# EAGLE design 2021_06_29_V7 (EAGLE 9.6.2)
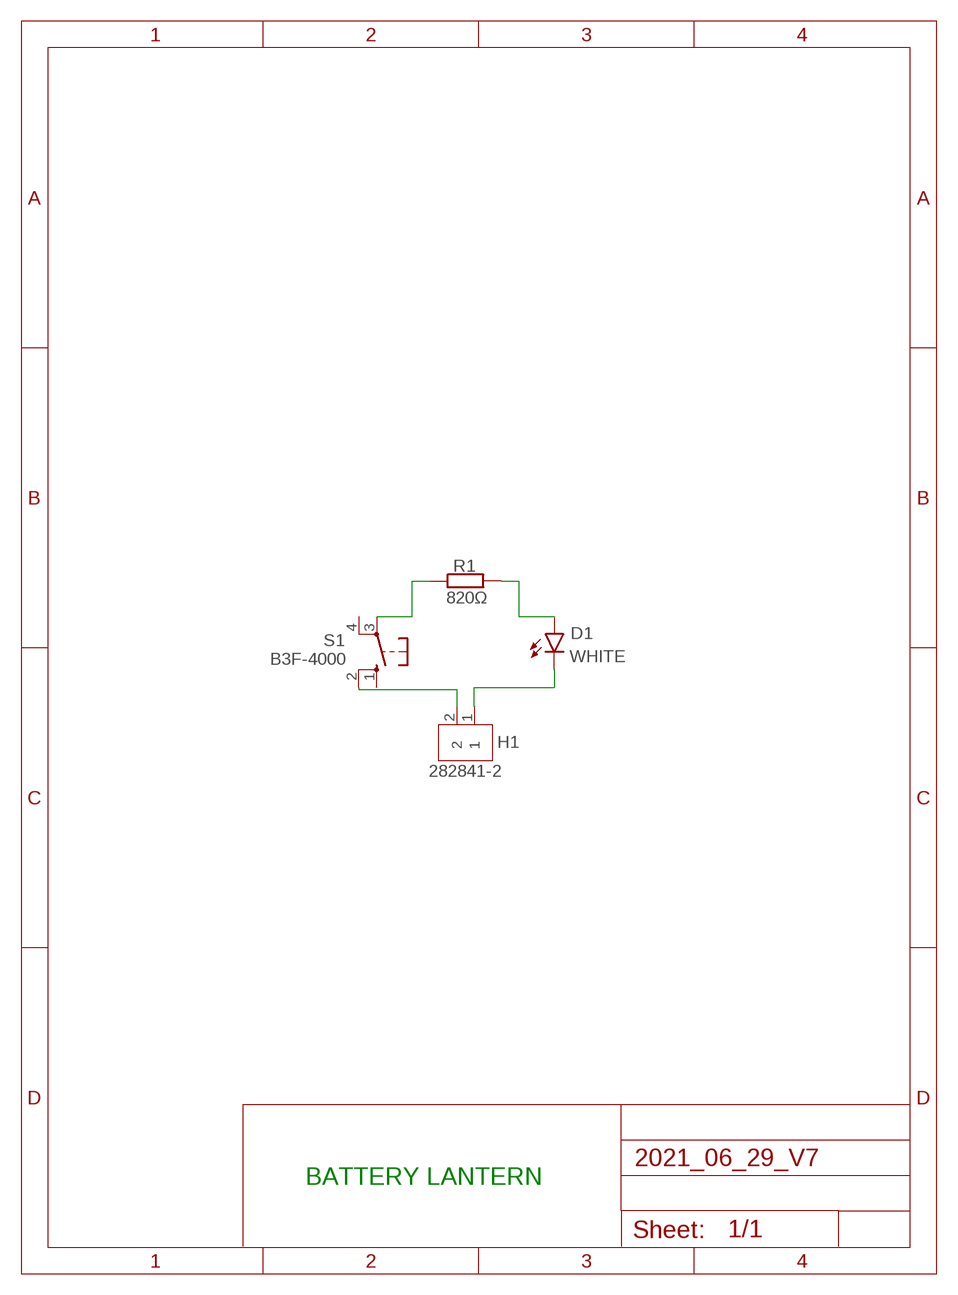
[diagram p0: schematic, sheet 1]

## Parts
D1  WHITE  LED_RADIAL_WHITE  [LEDRD254W60D565H860B_W]
H1  282841-2  2828XX-2282837-2  [TERMBLK_508-2N]
R1  820Ω  R-EU_0207/7  [0207/7]
S1  B3F-4000  40-XX  [B3F-40XX]

## Nets
N$1: H1.2 S1.2(S1)
N$2: R1.1 S1.3(P)
N$3: D1.1(A) R1.2
N$4: D1.2(C) H1.1
Unconnected: S1.1(S) S1.4(P1)

## Notes on the sheet
- BATTERY LANTERN

## Library data of the parts
D1 = Opto-Electronic_1:LED_RADIAL: LED - Generic; CATEGORY: Opto-Electronic; SUB-CATEGORY: LED; VALUE: LED_WHITE
H1 = Connector1:2828XX-2: 2 Position Wire to Board Terminal Block Horizontal with Board Datasheet <https://www.te.com.cn/commerce/DocumentDelivery/DDEController?Action=showdoc&DocId=Catalog+Section%7F1308389_EUROSTYLE_TERMINAL_BLOCKS%7F0607%7Fpdf%7FEnglish%7FENG_CS_1308389_EUROSTYLE_TERMINAL_BLOCKS_0607.pdf%7F2-282837-5>; CATEGORY: Connector; DESCRIPTION: 2 Position Wire to Board Terminal Block Horizontal with Board 5.08 mm Through Hole; MANUFACTURER: TE Connectivity; MPN: 282837-2; OPERATING_TEMPERATURE: -40°C to +105°C; PART_STATUS: ACTIVE; ROHS_COMPLIANCE: RoHS Compliant; SERIES: 282837; SUBCATEGORY: Terminal Block; TYPE: Side Wire Entry
R1 = rclv1:R-EU_: RESISTOR, European symbol; SPICEPREFIX: R
S1 = switch-omron:40-XX: OMRON SWITCH; MF: OMRON COMPONENTS USA; MPN: B3F-4000; OC_FARNELL: 176434; OC_NEWARK: 36K3105

## Board
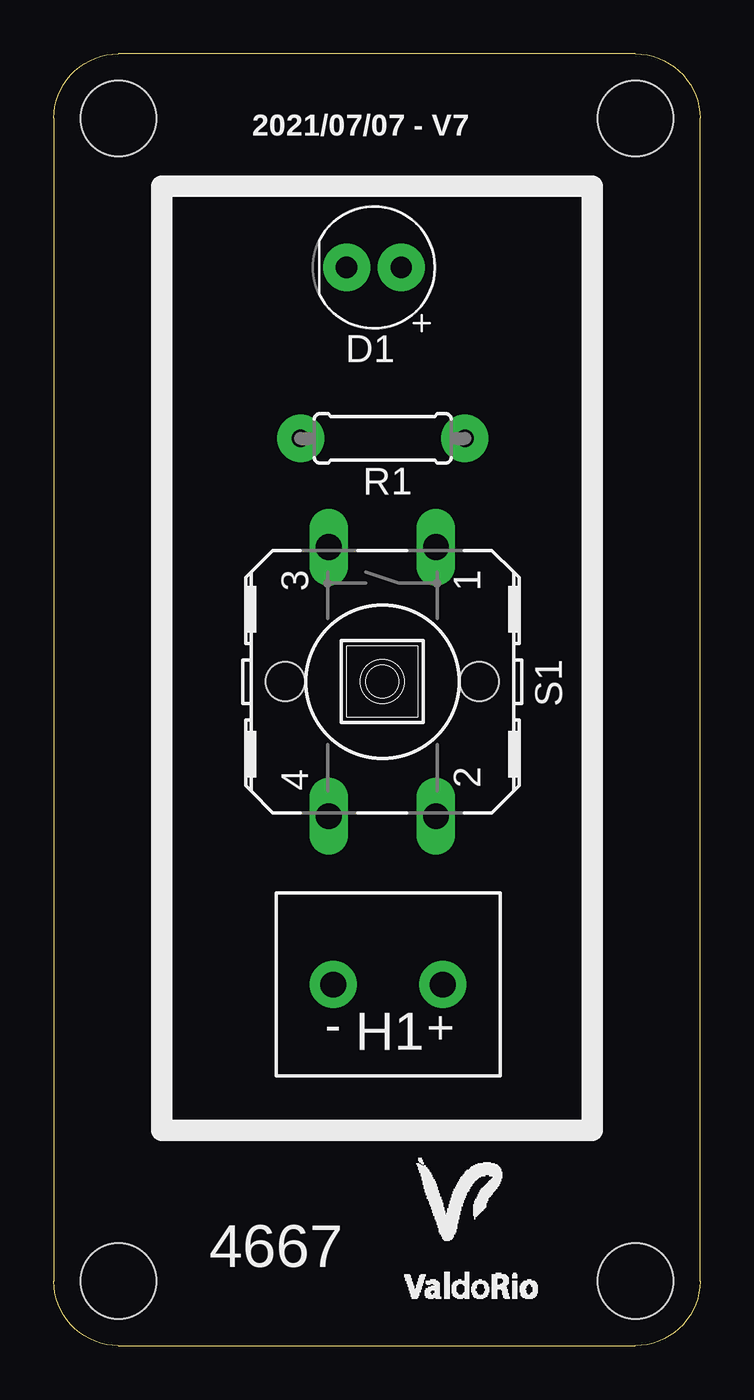
[diagram p1: board, top side]
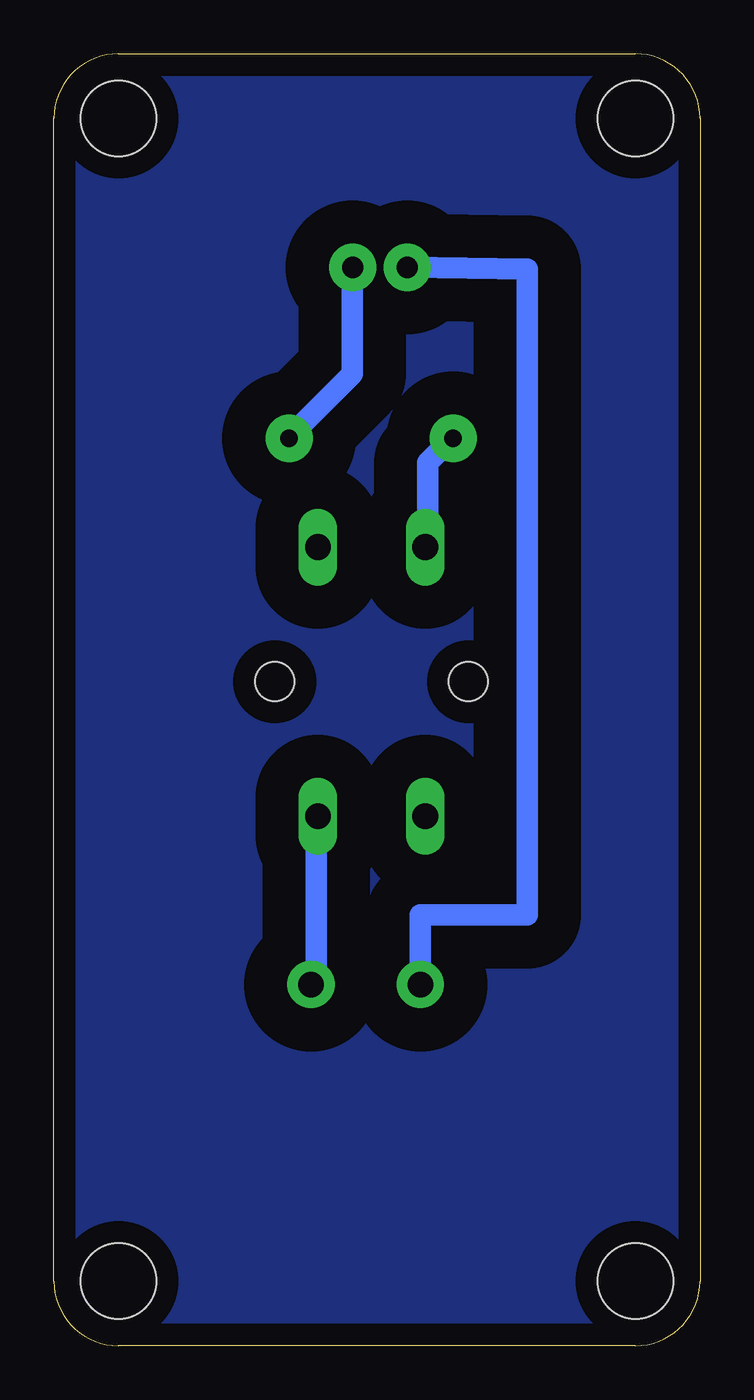
[diagram p2: board, bottom side, seen from below]

Size 30 x 60 mm. Coordinates in mm from the lower left corner, seen from the top.
Outline: 3,0 27,0 arc90 30,3 30,57 arc90 27,60 3,60 arc90 0,57 0,3 arc90 3,0
Copper layers (1*16): Top 0.035mm / dielectric 1.5mm / Bottom 0.035mm
Design rules "default *": minimum track width 1mm, minimum drill 0.35mm, track to track 2mm, track to pad 2mm, pad to pad 2mm, via to via 2mm, smd to smd 2mm, copper to edge 40mil, drill to drill 6mil, minimum pad ring 10mil, minimum via ring 8mil, stop-mask expansion 4mil, vias tented up to drill 0mil, thermal gap 10mil
Holes 3.5 mm at 27,3 3,3 3,57 27,57

### Footprints (pad centres in the part's own frame; a part is rotated, then mirrored left to right if it is on the bottom)
LEDRD254W60D565H860B_W = drill 0.981 pad 2.184: 1 -1.27,0; 2 1.27,0
TERMBLK_508-2N = drill 1.2 pad 2.184: 1 0,0; 2 5.08,0
0207/7 = drill 0.813 pad 2.184: 1 -3.81,0; 2 3.81,0
B3F-40XX = drill 1.194 long: 1 -6.248,2.489; 2 6.248,2.489; 3 -6.248,-2.489; 4 6.248,-2.489 | hole 1.803: 0,-4.496; 0,4.496

### Placement (x,y rotation side)
D1  14.86,50.08 180 top
H1  12.98,16.77 0 top
R1  15.27,42.14 0 top
S1  15.25,30.84 270 top

### Tracks (layer width: path | path; a pad name or v marks a point on that pad's centre or on a via)
N$1
  Bottom 1: S1.2 17.82,24.55 17.82,16.93 17.98,16.77 H1.2
N$2
  Bottom 1: S1.3 12.64,37.2 12.64,41.01 11.58,42.07 R1.1
N$3
  Bottom 1: D1.1 16.15,50 16.15,45.12 19.04,42.22 R1.2
N$4
  Bottom 1: D1.2 8.03,50.01 8.03,20 13,20 13,17 H1.1
N$5
  pour Bottom: 3,0 arc-90 0,3 0,57 arc-90 3,60 27,60 arc-90 30,57 30,3 arc-90 27,0

### Text on the board
tPlace: 2021/07/07 - V7 | - | + | 4667